# EAGLE design btob (EAGLE 9.6.2)
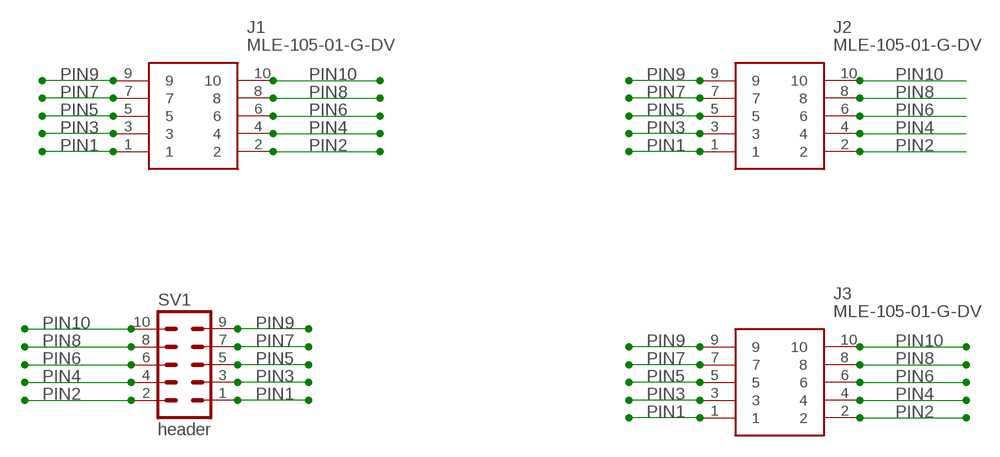
[diagram p0: schematic, sheet 1]

## Parts
J1  MLE-105-01-G-DV  [MLE-105-01-G-DV]
J2  MLE-105-01-G-DV  [MLE-105-01-G-DV]
J3  MLE-105-01-G-DV  [MLE-105-01-G-DV]
SV1  header  MA05-2  [MA05-2]

## Nets
PIN1: J1.1 J2.1 J3.1 SV1.1
PIN2: J1.2 J2.2 J3.2 SV1.2
PIN3: J1.3 J2.3 J3.3 SV1.3
PIN4: J1.4 J2.4 J3.4 SV1.4
PIN5: J1.5 J2.5 J3.5 SV1.5
PIN6: J1.6 J2.6 J3.6 SV1.6
PIN7: J1.7 J2.7 J3.7 SV1.7
PIN8: J1.8 J2.8 J3.8 SV1.8
PIN9: J1.9 J2.9 J3.9 SV1.9
PIN10: J1.10 J2.10 J3.10 SV1.10

## Library data of the parts
J1-J3 = MLE-105-01-G-DV:MLE-105-01-G-DV: 10 Position, 1.00 mm Tiger Beam™ Cost-Effective Single Beam Socket Strip Source: Datasheet <http://suddendocs.samtec.com/prints/mle-1xx-xx-x-dv-x-mkt1.pdf>; DESCRIPTION: 10 Position, 1.00 mm Tiger Beam&trade; Cost-Effective Single Beam Socket Strip; HEIGHT: mm; MANUFACTURER_NAME: SAMTEC; MANUFACTURER_PART_NUMBER: MLE-105-01-G-DV; MOUSER_PART_NUMBER: 200-MLE10501GDV; MOUSER_PRICE-STOCK: https://www.mouser.co.uk/ProductDetail/Samtec/MLE-105-01-G-DV?qs=rU5fayqh%252BE2dXiDvl4XeQQ%3D%3D
SV1 = con-lstb:MA05-2: PIN HEADER; OC_FARNELL: unknown; OC_NEWARK: unknown

## Board
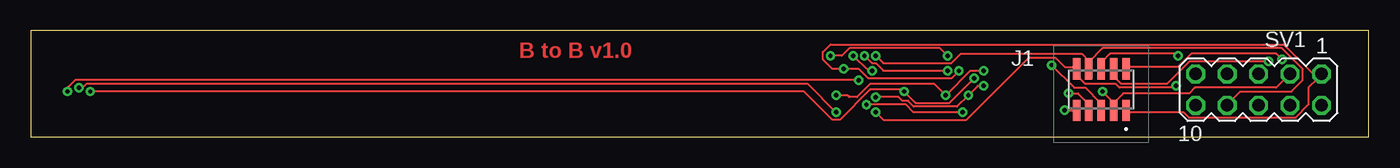
[diagram p1: board, top side]
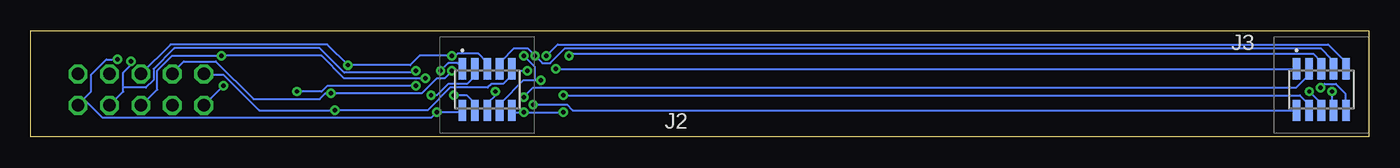
[diagram p2: board, bottom side, seen from below]

Size 107.93 x 8.56 mm. Coordinates in mm from the lower left corner, seen from the top.
Outline: 0,0 107.93,0 107.93,8.56 0,8.56 0,0
Copper layers (1*16): Top 0.035mm / dielectric 1.5mm / Bottom 0.035mm
Design rules "default": minimum track width 6mil, minimum drill 0.35mm, track to track 6mil, track to pad 6mil, pad to pad 6mil, via to via 6mil, smd to smd 6mil, copper to edge 40mil, drill to drill 6mil, minimum pad ring 10mil, minimum via ring 8mil, stop-mask expansion 4mil, vias tented up to drill 0mil, thermal gap 10mil

### Footprints (pad centres in the part's own frame; a part is rotated, then mirrored left to right if it is on the bottom)
MLE-105-01-G-DV = smd 0.61 x 1.709: 1 2,-1.685; 2 2,1.685; 3 1,-1.685; 4 1,1.685; 5 0,-1.685; 6 0,1.685; 7 -1,-1.685; 8 -1,1.685; 9 -2,-1.685; 10 -2,1.685
MA05-2 = drill 1.016 octagon: 1 -5.08,-1.27; 2 -5.08,1.27; 3 -2.54,-1.27; 4 -2.54,1.27; 5 0,-1.27; 6 0,1.27; 7 2.54,-1.27; 8 2.54,1.27; 9 5.08,-1.27; 10 5.08,1.27

### Placement (x,y rotation side)
J1  86.36,3.81 0 top
J2  71.12,3.81 180 bottom
J3  3.81,3.81 180 bottom
SV1  99.06,3.81 180 top

### Tracks (layer width: path | path; a pad name or v marks a point on that pad's centre or on a via)
PIN1  (via drill 0.35)
  Top 0.152: 103.84,4.72 104.14,5.03 SV1.1 103.84,4.72 | 103.84,4.72 103.07,3.96 103.07,2.59 102.01,1.52 93.47,1.52 93.02,1.98 88.44,1.98 J1.1 | v74.88,5.33 74.27,4.72 67.56,4.72 66.8,5.49 v65.58,5.49 64.67,5.49 63.91,6.25 63.91,6.86 64.52,7.47 101.09,7.47 103.84,4.72
  Bottom 0.152: v65.58,5.49 5.84,5.49 J3.1 | v74.88,5.33 74.27,5.94 73.51,5.94 73.2,5.64 J2.1
PIN2  (via drill 0.35)
  Top 0.152: v100.94,6.25 100.48,6.71 93.62,6.71 92.56,5.64 88.44,5.64 J1.2 | v67.41,2.59 70.61,2.59 71.22,1.98 v75.18,1.98
  Bottom 0.152: v100.94,6.25 101.85,6.25 103.07,5.03 103.07,3.66 103.68,3.05 | 103.68,3.05 104.14,2.59 SV1.2 103.68,3.05 | v67.41,2.59 64.67,2.59 64.21,2.13 5.84,2.13 J3.2 | J2.2 73.2,1.98 v75.18,1.98 75.64,1.52 102.16,1.52 103.68,3.05
PIN3  (via drill 0.35)
  Top 0.152: 87.38,2.74 87.38,2.13 J1.3 87.38,2.74 | 87.38,2.74 88.14,3.51 93.47,3.51 93.93,3.96 100.48,3.96 SV1.3 | v68.17,3.2 70,3.2 70.31,2.9 70.76,2.9 71.22,2.44 74.73,2.44 v75.64,3.35 76.4,4.12 v76.86,4.12 | v86.46,3.66 87.38,2.74
  Bottom 0.152: v68.17,3.2 67.41,3.96 5.84,3.96 4.93,4.88 4.93,5.49 J3.3 | v75.64,3.35 75.18,3.35 74.27,4.27 72.75,4.27 72.14,4.88 72.14,5.49 J2.3 | v86.46,3.66 84.48,3.66 84.02,4.12 v76.86,4.12
PIN4  (via drill 0.35)
  Top 0.152: v99.87,6.1 93.47,6.1 91.64,4.27 87.99,4.27 87.38,4.88 87.38,5.49 J1.4 | v64.97,3.35 65.89,3.35 66.04,3.2 66.65,3.2 67.72,4.27 72.9,4.27 v73.81,3.35 75.79,5.33 v76.86,5.33
  Bottom 0.152: v99.87,6.1 99.87,5.79 100.48,5.18 100.48,3.96 | 100.48,3.96 100.48,3.66 SV1.4 | v64.97,3.35 5.54,3.35 4.93,2.74 4.93,2.13 J3.4 | v73.81,3.35 72.75,3.35 72.14,2.74 72.14,2.13 J2.4 | 100.48,3.96 98.65,3.96 98.04,4.57 98.04,5.49 96.37,7.16 84.63,7.16 82.65,5.18 77.01,5.18 v76.86,5.33
PIN5  (via drill 0.35)
  Top 0.152: v64.52,6.55 65.43,6.55 66.04,7.16 73.36,7.16 v73.97,6.55 | v82.35,5.79 84.18,3.96 85.09,3.96 86.31,2.74 86.31,2.13 J1.5
  Bottom 0.152: v64.52,6.55 64.36,6.71 4.47,6.71 3.86,6.1 3.86,5.64 J3.5 | J2.5 71.22,5.64 71.22,6.1 71.83,6.71 73.51,6.71 73.66,6.55 v73.97,6.55 76.56,6.55 77.32,5.79 v82.35,5.79 84.02,7.47 96.67,7.47 SV1.5
PIN6  (via drill 0.35)
  Top 0.152: v92.56,6.55 92.41,6.71 87.07,6.71 86.46,6.1 86.46,5.64 J1.6 | v4.78,3.66 62.38,3.66 64.67,1.37 65.28,1.37 67.72,3.81 70.31,3.81 v70.46,3.66 71.37,2.74 74.12,2.74 v76.1,4.72
  Bottom 0.152: SV1.6 98.96,2.59 97.74,3.81 97.74,5.33 96.52,6.55 v92.56,6.55 84.48,6.55 82.65,4.72 v76.1,4.72 | v4.78,3.66 3.86,2.74 3.86,2.13 J3.6 | v70.46,3.66 70.46,3.35 71.07,2.74 71.07,2.13 J2.6
PIN7  (via drill 0.35)
  Top 0.152: v83.72,3.51 84.48,3.51 85.24,2.74 85.24,2.13 J1.7 | v73.97,5.33 68.78,5.33 68.17,5.94 67.87,5.94 v67.26,6.55
  Bottom 0.152: SV1.7 96.52,5.18 95.61,6.1 93.02,6.1 89.97,3.05 84.63,3.05 84.18,3.51 v83.72,3.51 76.4,3.51 75.18,4.72 74.57,4.72 v73.97,5.33 | J3.7 2.95,5.64 2.95,6.25 3.86,7.16 64.82,7.16 66.04,5.94 66.65,5.94 v67.26,6.55 67.87,7.16 68.94,7.16 70,6.1 70,5.64 J2.7
PIN8  (via drill 0.35)
  Top 0.152: 85.4,6.1 85.4,5.64 J1.8 85.4,6.1 | 85.4,6.1 86.46,7.16 100.94,7.16 102.62,5.49 102.62,4.57 101.7,3.66 97.59,3.66 96.52,2.59 SV1.8 | v2.95,3.66 2.95,3.96 3.56,4.57 v66.8,4.57 | 85.4,6.1 84.79,6.71 75.03,6.71 74.27,5.94 68.78,5.94 v68.17,6.55
  Bottom 0.152: v2.95,3.66 2.95,2.13 J3.8 | 67.26,4.57 68.17,4.57 70,2.74 70,2.13 J2.8 | 67.26,4.57 v66.8,4.57 | v68.17,6.55 67.26,5.64 67.26,4.57
PIN9  (via drill 0.35)
  Top 0.152: v83.41,2.13 84.33,2.13 J1.9 | v66.34,6.55 67.56,5.33 v67.87,5.33
  Bottom 0.152: SV1.9 93.93,5.03 92.41,5.03 89.51,2.13 v83.41,2.13 75.95,2.13 74.12,3.96 71.07,3.96 70.76,4.27 69.85,4.27 68.78,5.33 | v66.34,6.55 65.43,7.47 3.25,7.47 1.88,6.1 1.88,5.64 J3.9 | 68.78,5.33 68.94,5.33 69.09,5.49 J2.9 | 68.78,5.33 v67.87,5.33
PIN10  (via drill 0.35)
  Top 0.152: v92.41,4.12 92.25,3.96 87.83,3.96 87.53,4.27 85.09,4.27 84.48,4.88 84.48,5.49 J1.10 84.33,5.64 83.41,5.64 82.65,6.4 80.52,6.4 75.49,1.37 68.78,1.37 v68.17,1.98 | v3.86,3.96 4.17,3.96 4.47,4.27 62.69,4.27 v64.97,1.98
  Bottom 0.152: SV1.10 v92.41,4.12 | v3.86,3.96 3.56,4.27 2.64,4.27 1.88,3.51 1.88,2.13 J3.10 | v64.97,1.98 v68.17,1.98 69.09,1.98 J2.10

### Text on the board
Top: B to B v1.0